# Altium schematic sheet TTTQ20_STM32-project__Schematic1_4__1_P1.schdoc
size 307 x 218 mm; Symbol: Drawing-Symbol_A4; Device: Drawing-Symbol_A4; Company: 嘉立创EDA; Version: V1.0; Page Size: A4; @Project Name: 智能家居ASRPRO2; @Page Count: 1; @Update Date: 2025-06-03; @Create Date: 2025-06-03; @Schematic Name: Schematic1_3; @Page No: 1; @Page Name: P1; @Create Time: 21:27:41; @Update Time: 21:30:15; Width: 1170; Height: 825; Region Start: 1; X Region Count: 6; Y Region Count: 4; Blade Width: 10; Title Block Position: 3; @Board Name: Board1_3
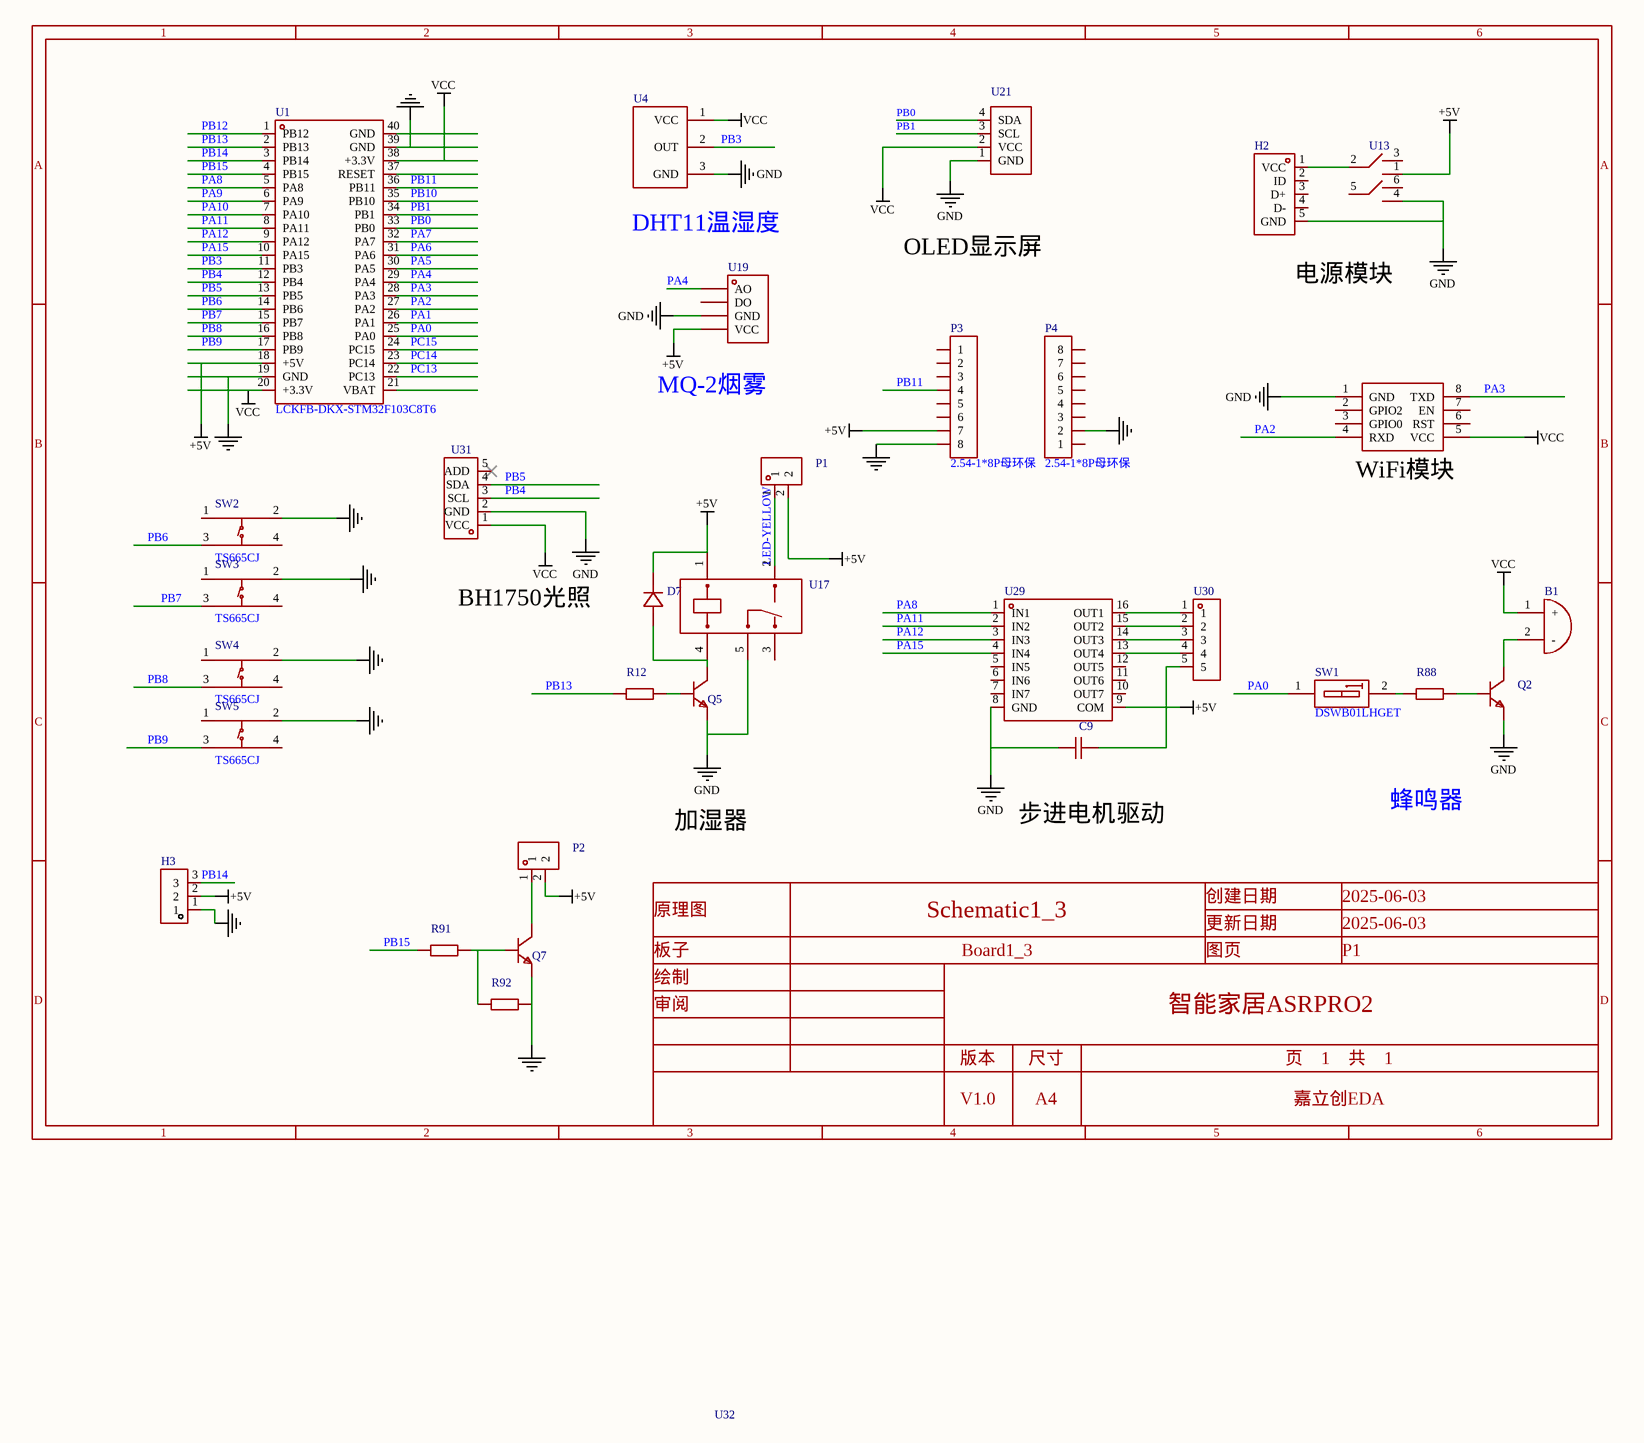
[diagram p0: TTTQ20_STM32-project__Schematic1_4__1_P1.schdoc]

## Parts
B1  蜂鸣器FMQ  [footprint_3c01]  (value not drawn)
C9  瓷片电容47PF  3KV  [CAP-TH_L5.0-W4.0-P5.00-D1.0]  (value not drawn)
D7  D_1N4007A  [DO_1N4007]  (value not drawn)
H2  mini USB  [MINI-USB-POWER]  (value not drawn)
H3  (no value)  [HDR-TH_3P-P2.54-V-F]
P1  XH2.54直插座-2P  [CONN-TH_XH2.54-2P]  (value not drawn)
P2  XH2.54直插座-2P  [CONN-TH_XH2.54-2P]  (value not drawn)
P3  2.54-1*8P母环保  [HDR-TH_8P-P2.54-V-F-1]
P4  2.54-1*8P母环保  [HDR-TH_8P-P2.54-V-F-1]
Q2  S8050_TO_NPN  [S8050_TO_92]  (value not drawn)
Q5  S8050_TO_NPN  [S8050_TO_92]  (value not drawn)
Q7  S8050_TO_NPN  [S8050_TO_92]  (value not drawn)
R12  1K  [Res_1/4W]  (value not drawn)
R88  10kΩ  [Res_1/4W]  (value not drawn)
R91  10kΩ  [Res_1/4W]  (value not drawn)
R92  10kΩ  [Res_1/4W]  (value not drawn)
SW1  DSWB01LHGET  [SW-TH_DSWB01LHGET]
SW2  TS665CJ  [SW-TH_4P-L6.0-W6.0-P4.50-LS6.5]
SW3  TS665CJ  [SW-TH_4P-L6.0-W6.0-P4.50-LS6.5]
SW4  TS665CJ  [SW-TH_4P-L6.0-W6.0-P4.50-LS6.5]
SW5  TS665CJ  [SW-TH_4P-L6.0-W6.0-P4.50-LS6.5]
U1  LCKFB-DKX-STM32F103C8T6  [CONN-TH_L53.3-W22.9_STM32F103C8T6-CARD]
U4  DHT11温湿度传感器  [DHT11]  (value not drawn)
U13  按键开关7*7  [footprint_7245]  (value not drawn)
U17  继电器5V  [footprint_0775]  (value not drawn)
U19  MQ系列4针传感器  [footprint_df71]  (value not drawn)
U21  OLED四针0.96寸  [footprint_0ab5]  (value not drawn)
U29  ULN2003A  [DIP-16_L20.0-W6.4-P2.54-LS7.6-BL]  (value not drawn)
U30  步进电机  [conn-th_5p-p2.54_xh2.54_5p_dip]  (value not drawn)
U31  GY302光照传感器  [footprint_6163]  (value not drawn)
U32  ESP8266-01S模块  [footprint_fe65]  (value not drawn)

## Nets
+5V: C9.2 D7.1(K) H3.2 P1.2 P2.2 P3.7 U1.18(+5V) U13.1 U17.1 U19.4(VCC) U29.9(COM) U30.5
GND: C9.1 H2.5(GND) H3.1 P3.8 P4.2 Q2.1(E) Q5.1(E) Q7.1(E) R92.2 SW2.2(B) SW3.2(B) SW4.2(B) SW5.2(B) U1.19(GND) U1.39(GND) U1.40(GND) U4.3(GND) U13.4 U17.5 U19.3(GND) U21.1(GND) U29.8(GND) U31.2(GND) U32.1(GND)
VCC: B1.1(+) U1.20(+3.3V) U1.38(+3.3V) U4.1(VCC) U21.2(VCC) U31.1(VCC) U32.5(VCC)
LED-YELLOW: P1.1 U17.2
PA0: SW1.1(A1) U1.25(PA0)
PA1: U1.26(PA1)
PA2: U1.27(PA2) U32.4(RXD)
PA3: U1.28(PA3) U32.8(TXD)
PA4: U1.29(PA4) U19.1(AO)
PA5: U1.30(PA5)
PA6: U1.31(PA6)
PA7: U1.32(PA7)
PA8: U1.5(PA8) U29.1(IN1)
PA9: U1.6(PA9)
PA10: U1.7(PA10)
PA11: U1.8(PA11) U29.2(IN2)
PA12: U1.9(PA12) U29.3(IN3)
PA15: U1.10(PA15) U29.4(IN4)
PB0: U1.33(PB0) U21.4(SDA)
PB1: U1.34(PB1) U21.3(SCL)
PB3: U1.11(PB3) U4.2(OUT)
PB4: U1.12(PB4) U31.3(SCL)
PB5: U1.13(PB5) U31.4(SDA)
PB6: SW2.3(C) U1.14(PB6)
PB7: SW3.3(C) U1.15(PB7)
PB8: SW4.3(C) U1.16(PB8)
PB9: SW5.3(C) U1.17(PB9)
PB10: U1.35(PB10)
PB11: P3.4 U1.36(PB11)
PB12: U1.1(PB12)
PB13: R12.2 U1.2(PB13)
PB14: H3.3 U1.3(PB14)
PB15: R91.1 U1.4(PB15)
PC13: U1.22(PC13)
PC14: U1.23(PC14)
PC15: U1.24(PC15)
NetB1_2: B1.2(-) Q2.3(C)
NetD7_2: D7.2(A) Q5.3(C) U17.4
NetH2_1: H2.1(VCC) U13.2
NetP2_1: P2.1 Q7.3(C)
NetQ2_2: Q2.2(B) R88.2
NetQ5_2: Q5.2(B) R12.1
NetQ7_2: Q7.2(B) R91.2 R92.1
NetR88_1: R88.1 SW1.2
NetU29_13: U29.13(OUT4) U30.4
NetU29_14: U29.14(OUT3) U30.3
NetU29_15: U29.15(OUT2) U30.2
NetU29_16: U29.16(OUT1) U30.1

Not connected (* = marked no-connect by the designer): H2 2(ID) 3(D+) 4(D-); P3 1 2 3 5 6; P4 1 3 4 5 6 7 8; SW2 1(A) 4(D); SW3 1(A) 4(D); SW4 1(A) 4(D); SW5 1(A) 4(D); U1 21(VBAT) 37(RESET); U13 3 5 6; U17 3; U19 2(DO); U29 5(IN5) 6(IN6) 7(IN7) 10(OUT7) 11(OUT6) 12(OUT5); U31 5(ADD)*; U32 2(GPIO2) 3(GPIO0) 6(RST) 7(EN)

## Notes on the sheet
- DHT11温湿度
- OLED显示屏
- 电源模块
- (near U19) MQ-2烟雾
- (near U32) WiFi模块
- BH1750光照
- 加湿器
- 步进电机驱动
- 蜂鸣器
- 1
- 2
- 3
- 4
- 5
- 6
- A
- B
- C
- 原理图
- Schematic1_3
- 创建日期
- 更新日期
- 2025-06-03
- 板子
- 绘制
- Board1_3
- 图页
- P1
- D
- 审阅
- 版本
- 尺寸
- 智能家居ASRPRO2
- 页    1    共    1
- V1.0
- A4
- 嘉立创EDA

## Library data of the parts
B1 = 蜂鸣器FMQ: Add into BOM: yes; Origin Footprint: 蜂鸣器; Symbol: 蜂鸣器FMQ; Device: 蜂鸣器FMQ; Convert to PCB: yes; Design Item ID: 蜂鸣器FMQ
C9 = 瓷片电容47PF  3KV: Add into BOM: yes; Symbol: 瓷片电容47PF  3KV; Device: 瓷片电容47PF  3KV; LCSC Part Name: 47pF(47R) ±10% 3KV; Supplier Part: C19375; Manufacturer Part: 瓷片电容47PF  3KV; Supplier Footprint: Through Hole; JLCPCB Part Class: 扩展库; Datasheet: https://atta.szlcsc.com/upload/public/pdf/source/20151026/1457707498987.pdf; Supplier: LCSC; Convert to PCB: yes; Origin Footprint: CAP-TH_L5.0-W4.0-P5.00-D1.0; Design Item ID: 瓷片电容47PF  3KV
D7 = D_1N4007A: Add into BOM: yes; Check: false; Symbol: D_1N4007A; Device: D_1N4007A; Supplier Footprint: DO-41; Convert to PCB: yes; Origin Footprint: DO_1N4007; Design Item ID: D_1N4007A
H2 = mini USB: Add into BOM: yes; Check: false; Symbol: mini USB; Device: mini USB; Convert to PCB: yes; Origin Footprint: MINI-USB-POWER; Design Item ID: mini USB
H3 = HDR-F_2.54_1x3P: Symbol: PM254V-11-03-H85; Convert to PCB: yes; Device: HDR-F_2.54_1x3P; Add into BOM: yes; Supplier Part: C541850; Supplier Footprint: 插件
P1 P2 = XH2.54直插座-2P: Add into BOM: yes; Check: false; Symbol: XH2.54直插座-2P; Device: XH2.54直插座-2P; LCSC Part Name: XH2.54直插座-2P; Supplier Part: C9900016957; Manufacturer Part: XH2.54直插座-2P; Supplier Footprint: XH2.54-2; JLCPCB Part Class: 扩展库; Datasheet: https://atta.szlcsc.comnull; Supplier: LCSC; Convert to PCB: yes; Origin Footprint: CONN-TH_XH2.54-2P; Design Item ID: XH2.54直插座-2P
P3 P4 = 2.54-1*8P母环保: Manufacturer: BOOMELE(博穆精密); Symbol: Header-Female-2.54_1x8; Add into BOM: yes; Holes Structure: 1x8P; Pitch: 2.54mm; Number of Holes: 8P; Device: 2.54-1*8P母环保; LCSC Part Name: 间距:2.54mm 1x8P 直插; Supplier Part: C27438; Manufacturer Part: 2.54-1*8P母环保; Supplier Footprint: 插件,P=2.54mm; JLCPCB Part Class: 扩展库; Datasheet: https://atta.szlcsc.com/upload/public/pdf/source/20231221/1CA800C6799ED97958773716FAA1BFFE.pdf; Supplier: LCSC; Convert to PCB: yes; Row Spacing: -; Mounting Type: 直插; Number of Rows: 单排; Insulation Height: -; Contact Material: -; Contact Plating: -
Q2 Q5 Q7 = S8050_TO_NPN: Convert to PCB: yes; Check: false; Symbol: S8050_TO_NPN; Device: S8050_TO_NPN; Add into BOM: yes; Supplier Footprint: TO-92; Origin Footprint: S8050_TO_92; Design Item ID: S8050_TO_NPN
R12 = 1K: Symbol: Res_AXIAL-1/4W; Add into BOM: yes; Check: false; Device: 1K; Supplier Footprint: 轴向引线; Convert to PCB: yes; Value: 1K; Origin Footprint: Res_1/4W; Design Item ID: Res_AXIAL-1/4W
R88 R91 R92 = 10kΩ: Symbol: Res_AXIAL-1/4W; Add into BOM: yes; Device: 10kΩ; Supplier Footprint: 轴向引线; Convert to PCB: yes; Value: 10kΩ; Origin Footprint: Res_1/4W; Design Item ID: Res_AXIAL-1/4W
SW1 = DSWB01LHGET: Manufacturer: YE; Add into BOM: yes; Circuit: 单刀单掷; Number of Positions: 1位; Symbol: DSWB01LHGET; Device: DSWB01LHGET; LCSC Part Name: 红色宽体1位顶拨插件; Supplier Part: C126888; Manufacturer Part: DSWB01LHGET; Supplier Footprint: 插件,9.9x4mm; JLCPCB Part Class: 扩展库; Datasheet: https://atta.szlcsc.com/upload/public/pdf/source/20240423/2AB41BE17D24959C6789B2A71E54D492.pdf; Supplier: LCSC; Convert to PCB: yes; Type: 平拨,凸起式; Lead Pitch: -; Operating Life: -; Color: 红色
SW2-SW5 = TS665CJ: Manufacturer: SHOU HAN(首韩); Add into BOM: yes; Circuit: 单刀单掷; Actuator Style: 圆形按钮; Switch Length: 6mm; Switch Height: 5mm; Contact Current: 50mA; Voltage Rating (DC): 12V; Symbol: TS665CJ; Device: TS665CJ; LCSC Part Name: 6*6*5mm 直插 轻触开关; Supplier Part: C393938; Manufacturer Part: TS665CJ; Supplier Footprint: 插件; JLCPCB Part Class: 扩展库; Datasheet: https://atta.szlcsc.com/upload/public/pdf/source/20190521/C393938_BDABEAC600B4C55E200A80AA129B70BC.pdf; Supplier: LCSC; Convert to PCB: yes; Mounting Style: 直插; Switch Width: 6mm; With Lamp: -; Mechanical Life: -
U1 = LCKFB-DKX-STM32F103C8T6: Manufacturer: 立创开发板; Add into BOM: yes; Symbol: LCKFB-DKX-STM32F103C8T6; Device: LCKFB-DKX-STM32F103C8T6; LCSC Part Name: 立创·地阔星-STM32F103C8T6开发板; Supplier Part: C22396880; Manufacturer Part: LCKFB-DKX-STM32F103C8T6; Supplier Footprint: -; JLCPCB Part Class: 扩展库; Datasheet: https://atta.szlcsc.com/upload/public/pdf/source/20240801/7EEF69F7480DF7C6DA98696664D658D4.pdf; Supplier: LCSC; Convert to PCB: yes
U4 = DHT11温湿度传感器: Add into BOM: yes; Check: false; Symbol: DHT11温湿度传感器; Device: DHT11温湿度传感器; Convert to PCB: yes; Origin Footprint: DHT11; Design Item ID: DHT11温湿度传感器
U13 = 按键开关7*7: Add into BOM: yes; Check: false; Symbol: 按键开关7*7; Device: 按键开关7*7; Convert to PCB: yes; Origin Footprint: 按键开关7*7; Design Item ID: 按键开关7*7
U17 = 继电器5V: Add into BOM: yes; Check: false; Origin Footprint: 继电器DC5V; Symbol: 继电器5V; Device: 继电器5V; Convert to PCB: yes; Design Item ID: 继电器5V
U19 = MQ系列4针传感器: Add into BOM: yes; Check: false; Symbol: MQ系列4针传感器; Device: MQ系列4针传感器; Convert to PCB: yes; Origin Footprint: MQ系列4针传感器; Design Item ID: MQ系列4针传感器
U21 = OLED四针0.96寸: Add into BOM: yes; Check: false; Origin Footprint: OLED4针0.96寸; Symbol: OLED四针0.96寸; Device: OLED四针0.96寸; Convert to PCB: yes; Design Item ID: OLED四针0.96寸
U29 = ULN2003A: Manufacturer: ST(意法半导体); Add into BOM: yes; Origin Footprint 1: ULN2003A_C93000; Symbol: ULN2003A; Device: ULN2003A; LCSC Part Name: ULN2003A; Supplier Part: C93000; Manufacturer Part: ULN2003A; Supplier Footprint: DIP-16; JLCPCB Part Class: 扩展库; Datasheet: https://atta.szlcsc.com/upload/public/pdf/source/20171116/C93000_15108227945891124497.pdf; Supplier: LCSC; Convert to PCB: yes; Origin Footprint 2: DIP-16_L20.0-W6.4-P2.54-LS7.6-BL; Design Item ID: ULN2003A
U30 = 步进电机: Add into BOM: yes; Origin Footprint 2: CONN-TH_HEADER5; Origin Footprint 1: Header5; Symbol: 步进电机; Device: 步进电机; LCSC Part Name: Header5; Supplier Part: C9900003337; Manufacturer Part: 步进电机; Supplier Footprint: XH2.54-P5; JLCPCB Part Class: 扩展库; Supplier: LCSC; Convert to PCB: yes; Design Item ID: 步进电机
U31 = GY302光照传感器: Add into BOM: yes; Symbol: GY302光照传感器; Device: GY302光照传感器; Convert to PCB: yes; Origin Footprint: GY302光照传感器; Design Item ID: GY302光照传感器
U32 = ESP8266-01S模块: Check: false; Add into BOM: yes; Symbol: ESP8266-01S模块; Device: ESP8266-01S模块; Convert to PCB: yes; Origin Footprint: ESP8266-01S模块; Design Item ID: ESP8266-01S模块